# EAGLE schematic flat (EAGLE 6.5.0)
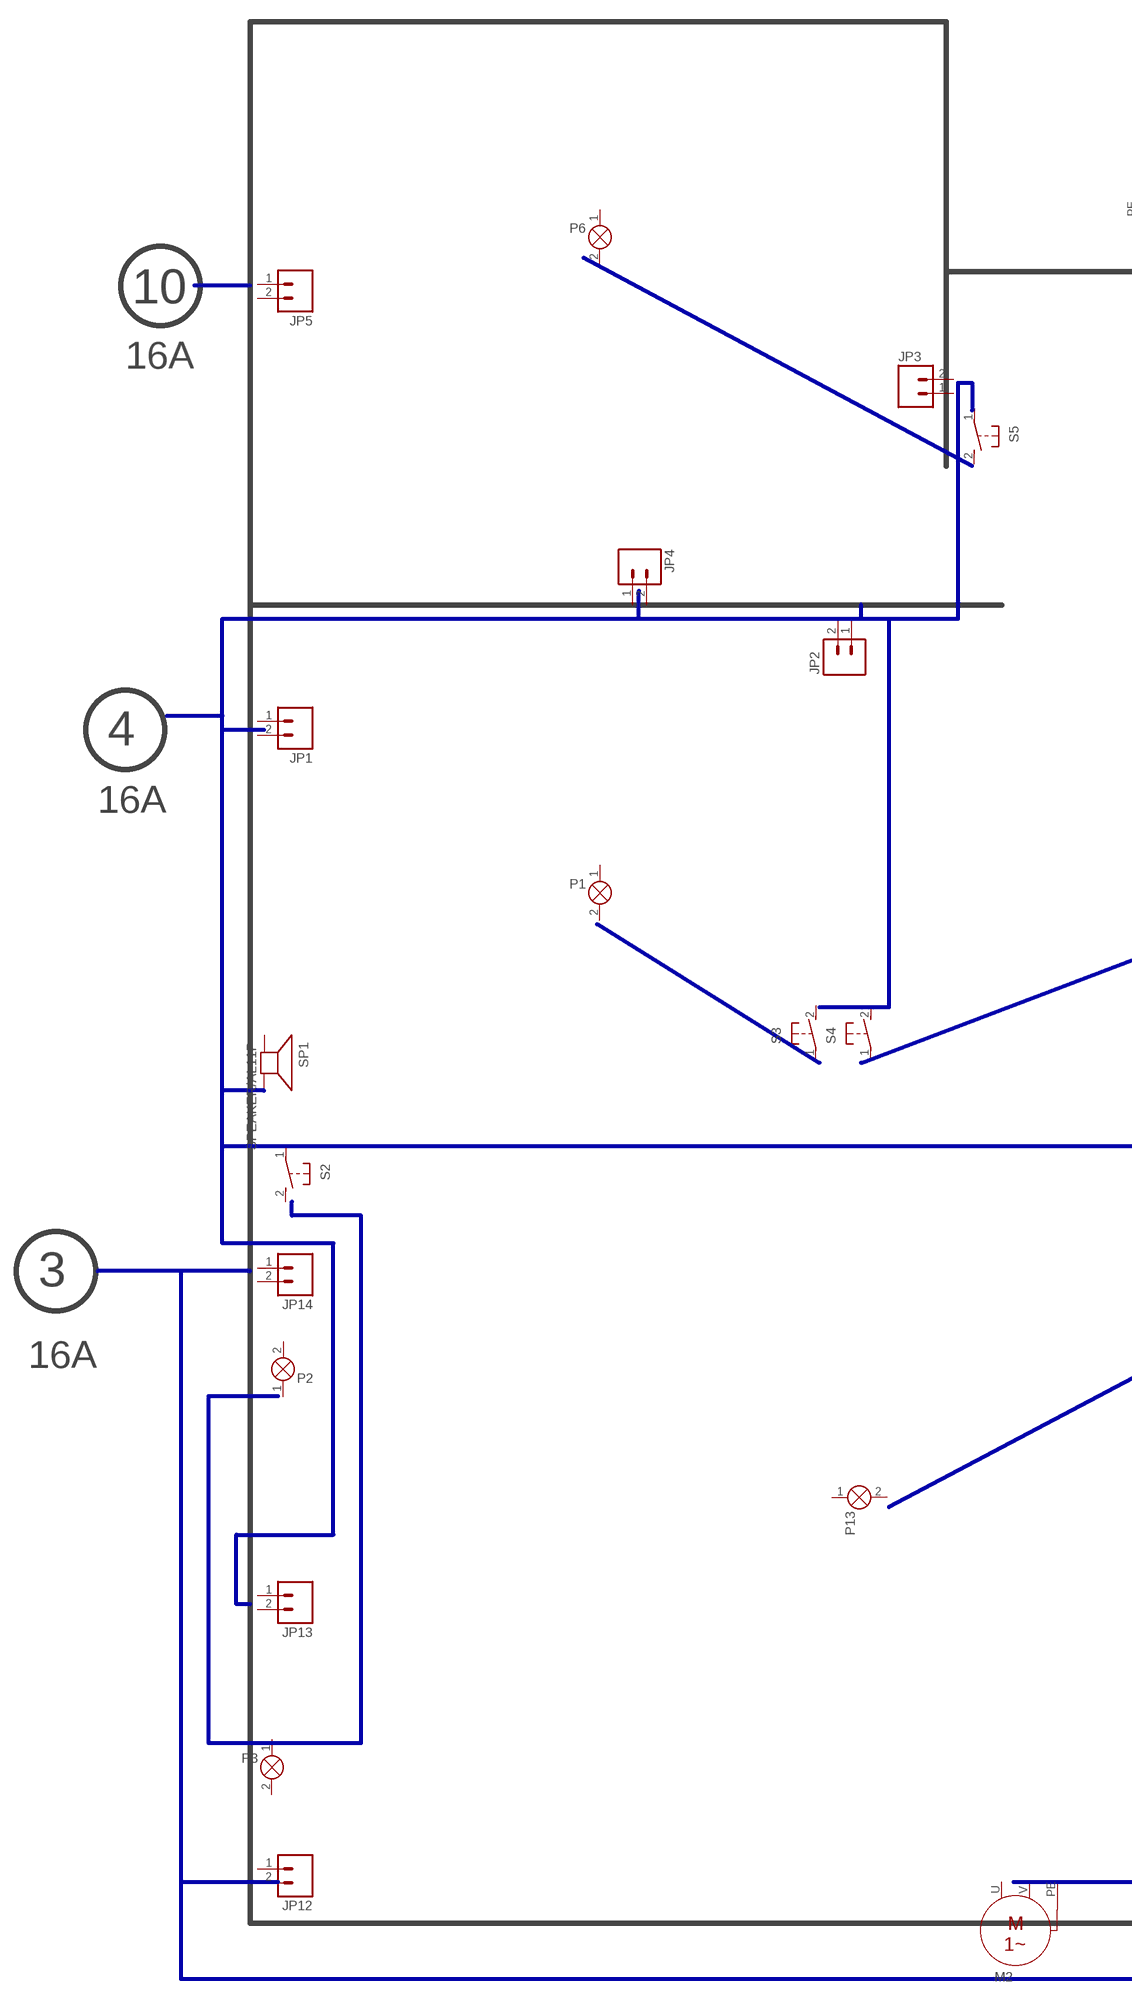
[diagram p0: schematic, sheet 1, part 1 of 2]
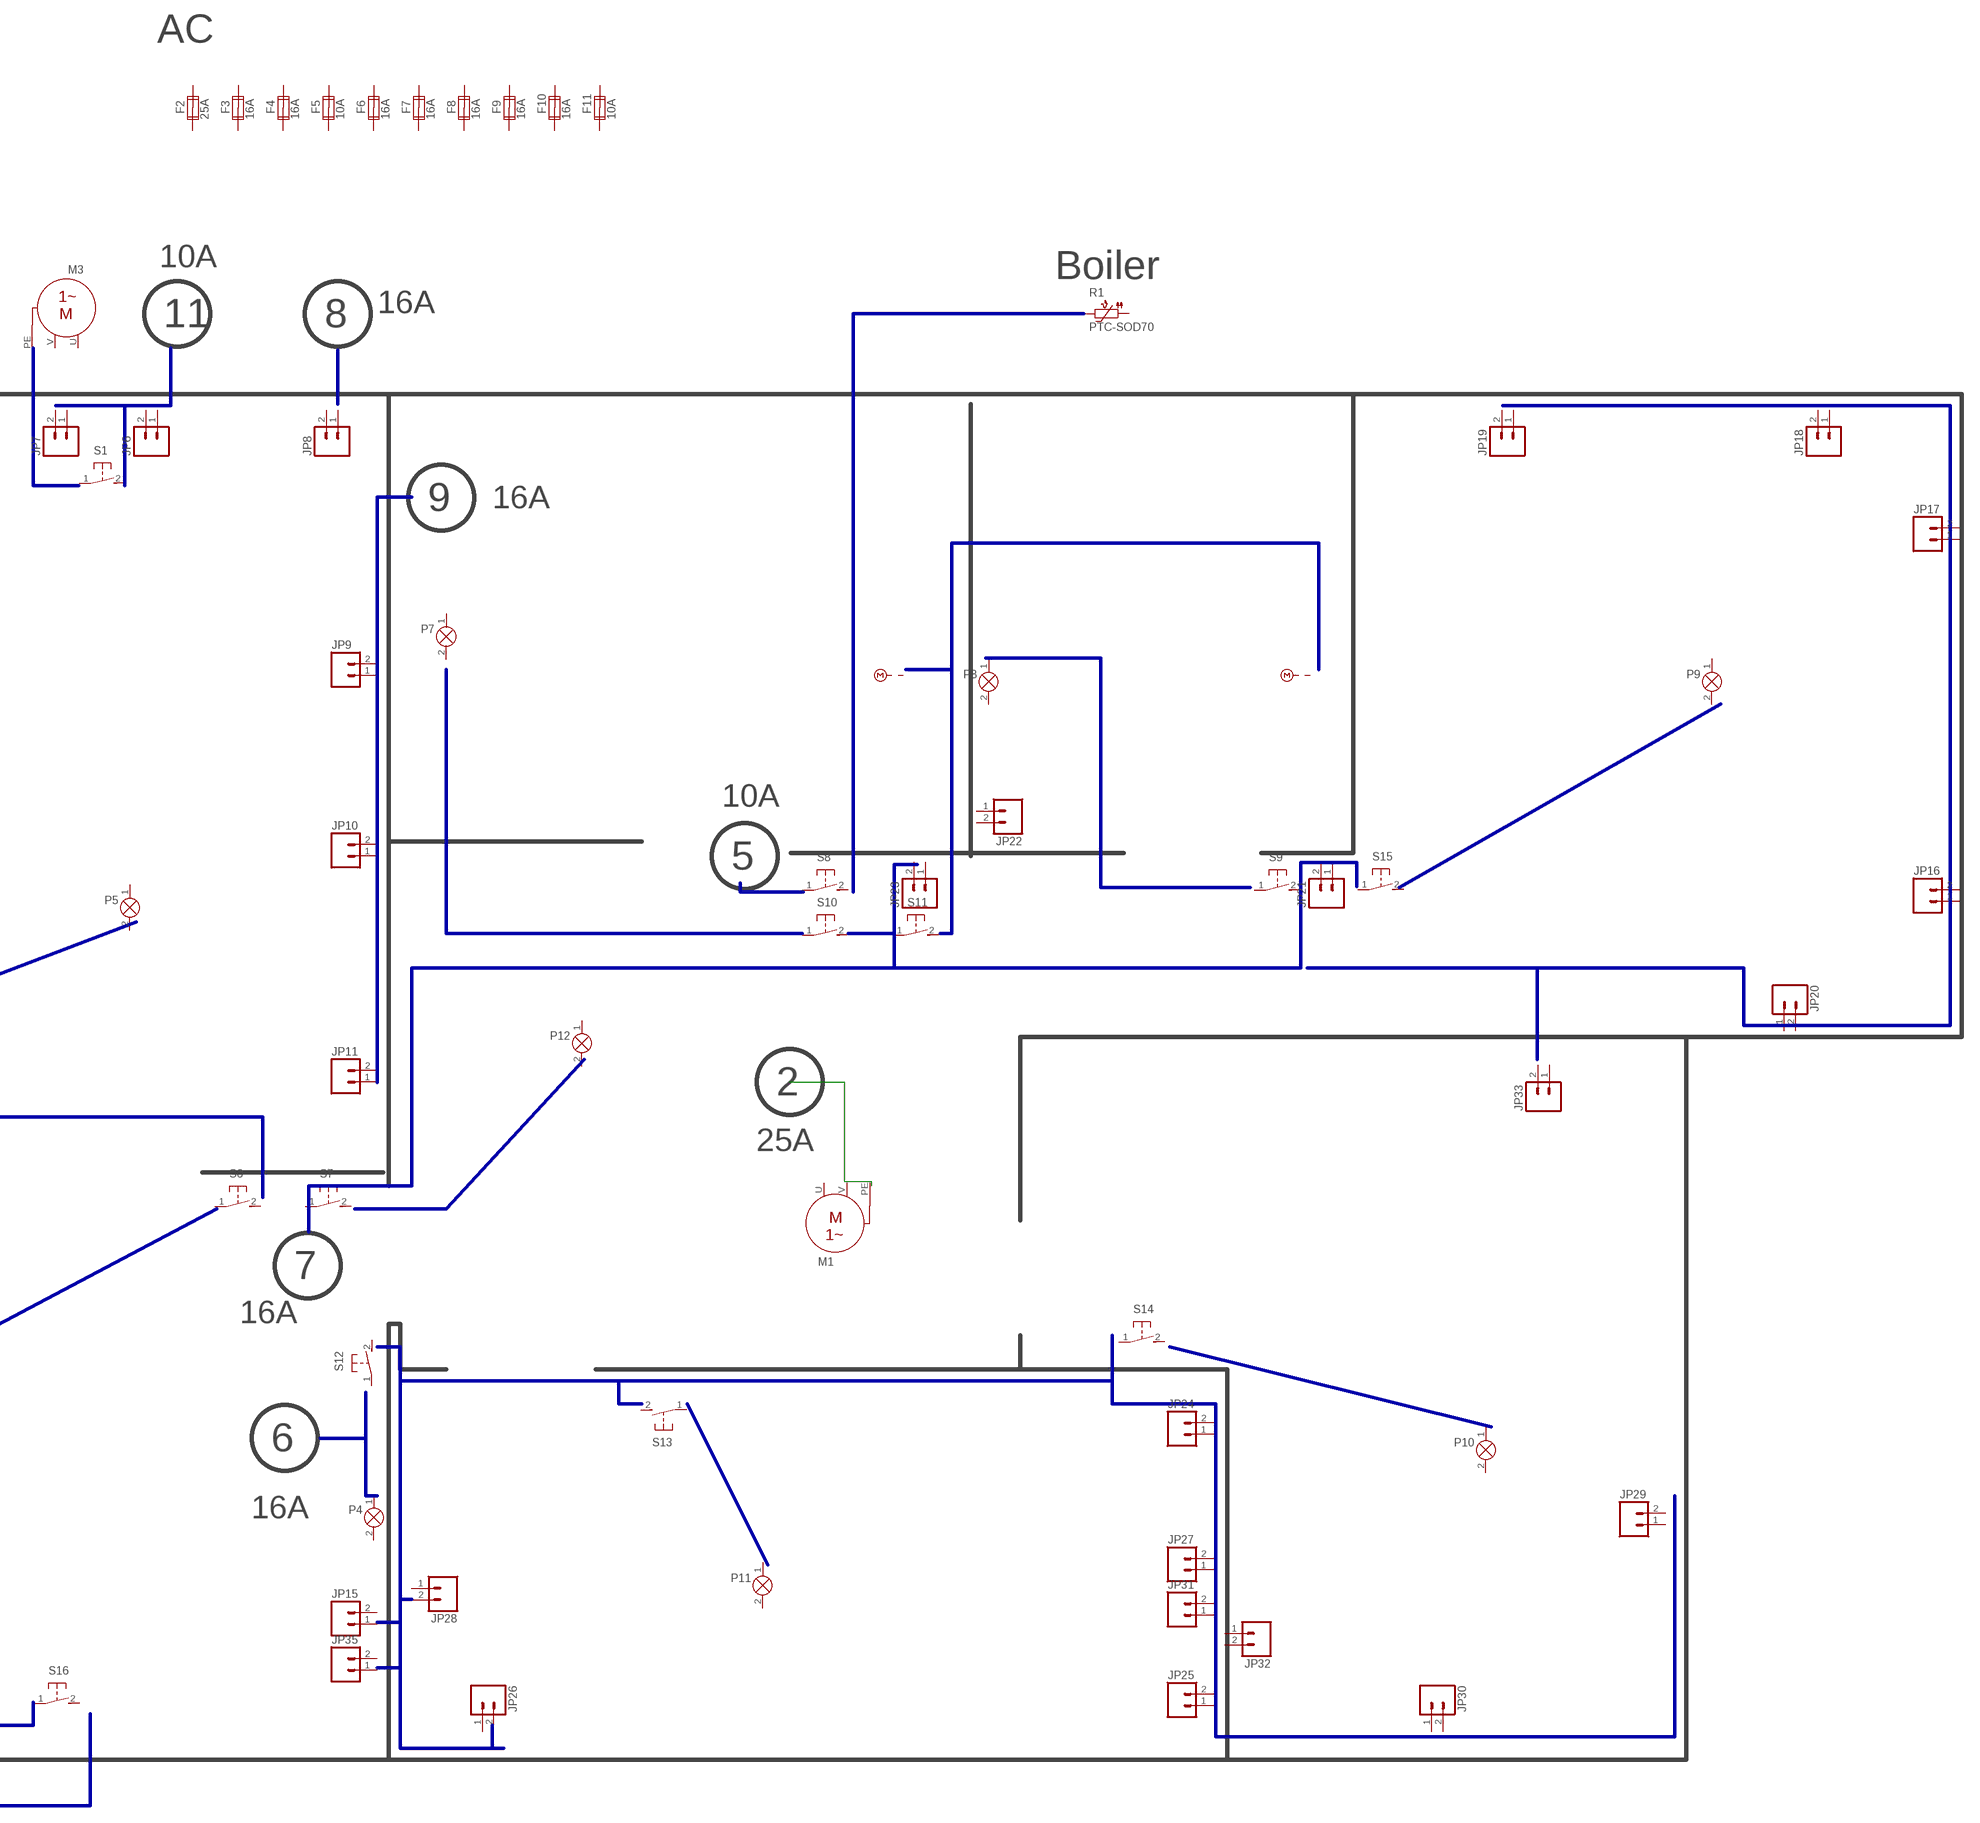
[diagram p1: schematic, sheet 1, part 2 of 2]

## Parts
F2  25A  FUSE2P  [FUSE1]
F3  16A  FUSE2P  [FUSE1]
F4  16A  FUSE2P  [FUSE1]
F5  10A  FUSE2P  [FUSE1]
F6  16A  FUSE2P  [FUSE1]
F7  16A  FUSE2P  [FUSE1]
F8  16A  FUSE2P  [FUSE1]
F9  16A  FUSE2P  [FUSE1]
F10  16A  FUSE2P  [FUSE1]
F11  10A  FUSE2P  [FUSE1]
JP1  M02-JST-2-PTH-NO_SILK  [JST-2-PTH-NS]
JP2  M02-JST-2-PTH-NO_SILK  [JST-2-PTH-NS]
JP3  M02-JST-2-PTH-NO_SILK  [JST-2-PTH-NS]
JP4  M02-JST-2-PTH-NO_SILK  [JST-2-PTH-NS]
JP5  M02-JST-2-PTH-NO_SILK  [JST-2-PTH-NS]
JP6  M02-JST-2-PTH-NO_SILK  [JST-2-PTH-NS]
JP7  M02-JST-2-PTH-NO_SILK  [JST-2-PTH-NS]
JP8  M02-JST-2-PTH-NO_SILK  [JST-2-PTH-NS]
JP9  M02-JST-2-PTH-NO_SILK  [JST-2-PTH-NS]
JP10  M02-JST-2-PTH-NO_SILK  [JST-2-PTH-NS]
JP11  M02-JST-2-PTH-NO_SILK  [JST-2-PTH-NS]
JP12  M02-JST-2-PTH-NO_SILK  [JST-2-PTH-NS]
JP13  M02-JST-2-PTH-NO_SILK  [JST-2-PTH-NS]
JP14  M02-JST-2-PTH-NO_SILK  [JST-2-PTH-NS]
JP15  M02-JST-2-PTH-NO_SILK  [JST-2-PTH-NS]
JP16  M02-JST-2-PTH-NO_SILK  [JST-2-PTH-NS]
JP17  M02-JST-2-PTH-NO_SILK  [JST-2-PTH-NS]
JP18  M02-JST-2-PTH-NO_SILK  [JST-2-PTH-NS]
JP19  M02-JST-2-PTH-NO_SILK  [JST-2-PTH-NS]
JP20  M02-JST-2-PTH-NO_SILK  [JST-2-PTH-NS]
JP21  M02-JST-2-PTH-NO_SILK  [JST-2-PTH-NS]
JP22  M02-JST-2-PTH-NO_SILK  [JST-2-PTH-NS]
JP23  M02-JST-2-PTH-NO_SILK  [JST-2-PTH-NS]
JP24  M02-JST-2-PTH-NO_SILK  [JST-2-PTH-NS]
JP25  M02-JST-2-PTH-NO_SILK  [JST-2-PTH-NS]
JP26  M02-JST-2-PTH-NO_SILK  [JST-2-PTH-NS]
JP27  M02-JST-2-PTH-NO_SILK  [JST-2-PTH-NS]
JP28  M02-JST-2-PTH-NO_SILK  [JST-2-PTH-NS]
JP29  M02-JST-2-PTH-NO_SILK  [JST-2-PTH-NS]
JP30  M02-JST-2-PTH-NO_SILK  [JST-2-PTH-NS]
JP31  M02-JST-2-PTH-NO_SILK  [JST-2-PTH-NS]
JP32  M02-JST-2-PTH-NO_SILK  [JST-2-PTH-NS]
JP33  M02-JST-2-PTH-NO_SILK  [JST-2-PTH-NS]
JP35  M02-JST-2-PTH-NO_SILK  [JST-2-PTH-NS]
M1  MOTOR_1-PHASEN  [MOTOR_1-PHASEN]
M2  MOTOR_1-PHASEN  [MOTOR_1-PHASEN]
M3  MOTOR_1-PHASEN  [MOTOR_1-PHASEN]
P1  SIGNALLAMPE  [LAMPE]
P2  SIGNALLAMPE  [LAMPE]
P3  SIGNALLAMPE  [LAMPE]
P4  SIGNALLAMPE  [LAMPE]
P5  SIGNALLAMPE  [LAMPE]
P6  SIGNALLAMPE  [LAMPE]
P7  SIGNALLAMPE  [LAMPE]
P8  SIGNALLAMPE  [LAMPE]
P9  SIGNALLAMPE  [LAMPE]
P10  SIGNALLAMPE  [LAMPE]
P11  SIGNALLAMPE  [LAMPE]
P12  SIGNALLAMPE  [LAMPE]
P13  SIGNALLAMPE  [LAMPE]
R1  PTC-SOD70  [SOD70]
S1  31-XX  [B3F-31XX]
S2  31-XX  [B3F-31XX]
S3  31-XX  [B3F-31XX]
S4  31-XX  [B3F-31XX]
S5  31-XX  [B3F-31XX]
S6  31-XX  [B3F-31XX]
S7  31-XX  [B3F-31XX]
S8  31-XX  [B3F-31XX]
S9  31-XX  [B3F-31XX]
S10  31-XX  [B3F-31XX]
S11  31-XX  [B3F-31XX]
S12  31-XX  [B3F-31XX]
S13  31-XX  [B3F-31XX]
S14  31-XX  [B3F-31XX]
S15  31-XX  [B3F-31XX]
S16  31-XX  [B3F-31XX]
SP1  SPEAKER/AL11P  [AL11P]
Unconnected: F2.1A F2.1B F2.2A F2.2B F3.1A F3.1B F3.2A F3.2B F4.1A F4.1B F4.2A F4.2B F5.1A F5.1B F5.2A F5.2B F6.1A F6.1B F6.2A F6.2B F7.1A F7.1B F7.2A F7.2B F8.1A F8.1B F8.2A F8.2B F9.1A F9.1B F9.2A F9.2B F10.1A F10.1B F10.2A F10.2B F11.1A F11.1B F11.2A F11.2B JP1.1 JP1.2 JP2.1 JP2.2 JP3.1 JP3.2 JP4.1 JP4.2 JP5.1 JP5.2 JP6.1 JP6.2 JP7.1 JP7.2 JP8.1 JP8.2 JP9.1 JP9.2 JP10.1 JP10.2 JP11.1 JP11.2 JP12.1 JP12.2 JP13.1 JP13.2 JP14.1 JP14.2 JP15.1 JP15.2 JP16.1 JP16.2 JP17.1 JP17.2 JP18.1 JP18.2 JP19.1 JP19.2 JP20.1 JP20.2 JP21.1 JP21.2 JP22.1 JP22.2 JP23.1 JP23.2 JP24.1 JP24.2 JP25.1 JP25.2 JP26.1 JP26.2 JP27.1 JP27.2 JP28.1 JP28.2 JP29.1 JP29.2 JP30.1 JP30.2 JP31.1 JP31.2 JP32.1 JP32.2 JP33.1 JP33.2 JP35.1 JP35.2 M1.PE M1.U M1.V M2.PE M2.U M2.V M3.PE M3.U M3.V P1.1(X1) P1.2(X2) P2.1(X1) P2.2(X2) P3.1(X1) P3.2(X2) P4.1(X1) P4.2(X2) P5.1(X1) P5.2(X2) P6.1(X1) P6.2(X2) P7.1(X1) P7.2(X2) P8.1(X1) P8.2(X2) P9.1(X1) P9.2(X2) P10.1(X1) P10.2(X2) P11.1(X1) P11.2(X2) P12.1(X1) P12.2(X2) P13.1(X1) P13.2(X2) R1.1 R1.2 S1.1(P) S1.2(S) S2.1(P) S2.2(S) S3.1(P) S3.2(S) S4.1(P) S4.2(S) S5.1(P) S5.2(S) S6.1(P) S6.2(S) S7.1(P) S7.2(S) S8.1(P) S8.2(S) S9.1(P) S9.2(S) S10.1(P) S10.2(S) S11.1(P) S11.2(S) S12.1(P) S12.2(S) S13.1(P) S13.2(S) S14.1(P) S14.2(S) S15.1(P) S15.2(S) S16.1(P) S16.2(S) SP1.+ SP1.-

## Buses
B$1
B$2
B$3
B$4
B$5
B$6
B$7
B$8
B$9
B$10
B$11
B$13
B$15
B$16
B$17
B$18
B$19
B$21
B$22
B$23
B$24
B$25
B$26
B$14
B$12
B$20

## Notes on the sheet
- AC
- 10A
- Boiler
- 16A
- 11 | 8
- 10
- 16A
- 9 | 16A
- 4
- 10A
- 16A
- 5
- 2
- 25A
- 3
- 7
- 16A
- 16A
- 6
- 16A

## Library data of the parts
F2-F11 = special:FUSE2P: FUSE 5 x 20 mm
JP1-JP33 JP35 = SparkFun-Connectors:M02: Header 2 Standard 2-pin 0.1" header. Use with straight break away headers (SKU : PRT-00116), right angle break away headers (PRT-00553), swiss pins (PRT-00743), machine pins (PRT-00117), and female headers (PRT-00115). Molex polarized connector foot print use with SKU : PRT-08233 with associated crimp pins and housings.
M1-M3 = e-motoren:MOTOR_1-PHASEN: 1-Phasen-Wechselstrom-Motor
P1-P13 = e-lampen-signalisation:SIGNALLAMPE: Lampe
R1 = ptc-ntc:PTC-: Positive Temperature Coefficient Resistor (PTC) termistor Philips KTY81-210 - KTY81-252 Source: 153627-da-01-en-Temperatur-Sensor_KTY10-6_Philips.pdf; OC_FARNELL: unknown; OC_NEWARK: unknown
S1-S16 = adafruit:31-XX: OMRON SWITCH Now with beefier pads!
SP1 = adafruit:SPEAKER: SPEAKER Source: Buerklin Added PS12 (for part # PS1240 piezo) http://www.ladyada.net/library/pcb/eaglelibrary.html